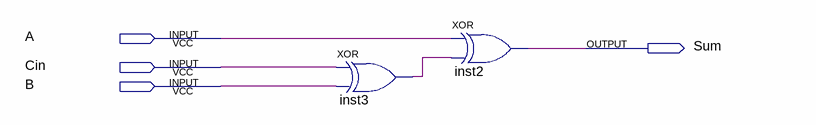
[diagram p0: schematic sheet]
// Quartus schematic 3_1_Adder.bdf as structural Verilog: 2 symbols, 4 pins
module \3_1_Adder  (
  input  A,
  input  Cin,
  input  B,
  output Sum
);

  wire inst3_out;

  xor inst3 (inst3_out, Cin, B);
  xor inst2 (Sum, A, inst3_out);
endmodule
